# Altium project STM32F407.PrjPcb
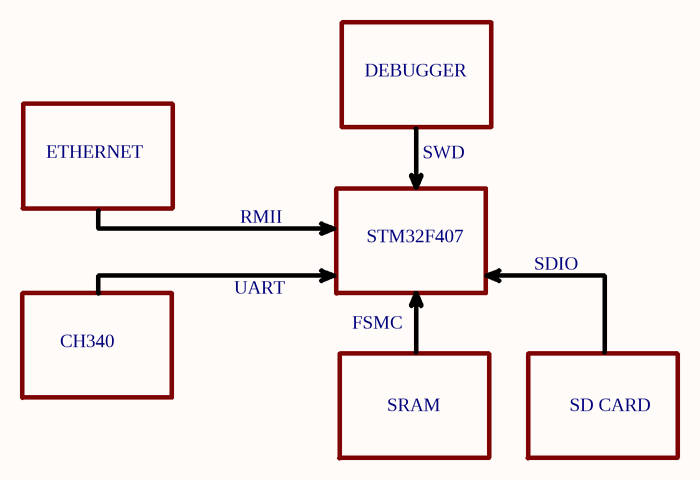
[diagram p0: Schematic block.SchDoc]
6 sheets, 146 parts. Net scope: flat (ports and power ports of the same name join across sheets).
Board file: F407-144pin.PcbDoc
Sheets:
  Schematic block.SchDoc
  Power.SchDoc
  ST-link V2.SchDoc
  MCU.SchDoc
  ETH.SchDoc
  Memory+GPIO.SchDoc

## Sheet Schematic block.SchDoc
size A4; SheetNumber: 1; SheetTotal: 6

### Notes on the sheet
- DEBUGGER
- ETHERNET
- SWD
- RMII
- UART
- STM32F407
- SDIO
- CH340
- FSMC
- SRAM
- SD CARD

## Sheet Power.SchDoc
size A4; SheetNumber: 2; SheetTotal: 6
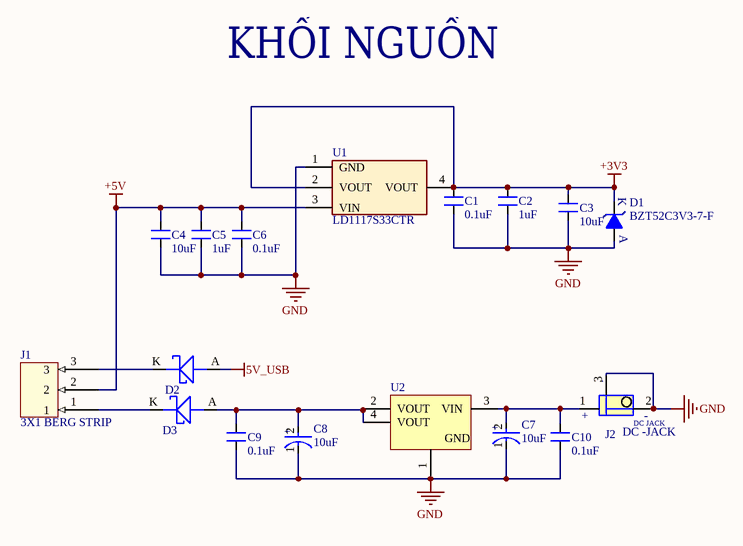
[diagram p1: Power.SchDoc]

### Parts
C1  0.1uF  [CAP_0805]
C2  1uF  [CAP_0805]
C3  10uF  [CAP_1206]
C4  10uF  [CAP_1206]
C5  1uF  [CAP_0805]
C6  0.1uF  [CAP_0805]
C7  10uF  [FP-293DA-MFG]
C8  10uF  [FP-293DA-MFG]
C9  0.1uF  [CAP_0805]
C10  0.1uF  [CAP_0805]
D1  BZT52C3V3-7-F  [DIO_SOD-123]
D2  MBRS130LT3G  [DIO_SMB_DO-214AA]  (value not drawn)
D3  MBRS130LT3G  [DIO_SMB_DO-214AA]  (value not drawn)
J1  3X1 BERG STRIP  [CON3_100_40D72_TH_ST-MALE]
J2  DC -JACK  [CON3_129_PJ-002A_TH_RA]
U1  LD1117S33CTR  [SOT223_3]
U2  LD1117S50CTR  [SOT-223_N]  (value not drawn)

### Nets
5V_USB: D2.A
+3V3: C1.2 C2.2 C3.2 D1.K U1.2(VOUT) U1.4(VOUT)
+5V: C4.2 C5.2 C6.2 J1.2 U1.3(VIN)
GND: C1.1 C2.1 C3.1 C4.1 C5.1 C6.1 C7.1(C) C8.1(C) C9.1 C10.1 D1.A J2.2 J2.3(-) U1.1(GND) U2.1(GND)
NetC7_2: C7.2(A) C10.2 J2.1 U2.3(VIN)
NetC8_2: C8.2(A) C9.2 D3.A U2.2(VOUT) U2.4(VOUT)
NetD2_K: D2.K J1.3
NetD3_K: D3.K J1.1

### Notes on the sheet
- KHỐI NGUỒN
- (in symbol CMP-00030-40940187-1) +
- (in symbol CON-PLG_3X1-228-DC_JACK) +; DC JACK

### Library data of the parts
C1 C6 C9 C10 = CAP_0.1uF-50V-10%-0805: 0.1µF ±10% 50V Ceramic Capacitor X7R 0805 (2012 Metric); Manufacturer: Samsung; Manufacturer Part Number: CL21B104KBCNNNC; Alternate Part Number-1: NA; Case/Package: 0805; Supplier-1: SIRICOM; Supplier Part Number-1: 0805B104K500CT
C2 C5 = CAP_1uF-50V-5%-0805: 1µF ±5% 50V Ceramic Capacitor X7R 0805 (2012 Metric); Manufacturer: Samsung; Manufacturer Part Number: CC0805JKX7R9BB105; Alternate Part Number-1: 0805F105M500NT; Case/Package: 0805; Supplier-1: SIRICOM; Supplier Part Number-1: CL21B105KBFNNNE
C3 C4 = CAP_10uF-50V-10%-1206: 10µF ±10% 50V Ceramic Capacitor X7R 1206 (3216 Metric); Manufacturer: KEMET; Manufacturer Part Number: CL31B106KBHNNNE; Alternate Part Number-1: GRT31CR61H106ME01L; Case/Package: 1206; Supplier-1: SIRICOM; Supplier Part Number-1: CC1206KKX5R9BB106
C7 C8 = CMP-00030-40940187-1: 293D105X0016A2TE3 Surface Mount Tantalum Capacitor, 1 uF, 16 V, ± 20%, -55 °C, 125 °C, 1206 [3216-18 Metric]; Ripple Current: 90mA; Capacitance: 1µF; Leakage Current: 500nA; Polarity: Polar; Voltage Rating (DC): 16V; Dissipation Factor: 4%; ESR (Equivalent Series Resistance): 9.3Ω; Case Code (Imperial): 1206; Case/Package: 1206; Schedule B: 8532210050, 8532210050; Height: 1.8mm; Mount: PCB, Surface Mount; Height - Seated (Max): 1.8034mm; Min Operating Temperature: -55°C; Max Operating Temperature: 125°C; Dielectric Material: Tantalum; Packaging: Tape and Reel; Radiation Hardening: No; Lead Free: Lead Free; Features: General Purpose; REACH SVHC: Unknown; Width: 1.6002mm; RoHS: Compliant; Tolerance: 20%; Termination: SMD/SMT; Length: 3.2mm; Depth: 1.6mm; Number of Pins: 2; Voltage Rating: 16V; NexarPartId: 40940187; Case Code (Metric): 3216
D1 = DIO-Z_3.3V-500mW-SOD123: Zener Diode 3.3V 500mW ±6% Surface Mount SOD-123; Manufacturer: Diodes Incorporated; Alternate Part Number-1: NA; Manufacturer Part Number: BZT52C3V3-7-F; Case/Package: SOD-123; Supplier-1: Digikey; Supplier Part Number-1: BZT52C3V3-FDICT-ND
D2 D3 = DIO-S_445mV-30V-2A-SMB: Diode Schottky 30V 2A Surface Mount SMB; Manufacturer: ON Semiconductor; Alternate Part Number-1: NA; Manufacturer Part Number: MBRS130LT3G; Case/Package: SMB; Supplier-1: ARROW; Supplier Part Number-1: MBRS130LT3G
J1 = CON-BS-PLG_3X1-100-ST-TH: 3 Pins, 1 Row 2.54mm Pitch, Straight bergstrip, Male; Manufacturer: NA; Manufacturer Part Number: RKI-1140; Case/Package: TH-CON; Supplier-1: SP ROAD; Supplier Part Number-1: NA; Alternate Part Number-1: NA
J2 = CON-PLG_3X1-228-DC_JACK: 3 Pins, 1 Row 228mil Pitch, right angle Connector, male; Manufacturer: JST; Manufacturer Part Number: PJ-002A; Alternate Part Number-1: NA; Case/Package: TH-CON; Supplier-1: SP ROAD; Supplier Part Number-1: NA
U1 = REG_15V-3.3V-0.9A-12W-SOT223: Linear Voltage Regulator IC 1 Output 800mA SOT-223; Manufacturer: STMicroelectronics; Alternate Part Number-1: NA; Manufacturer Part Number: LD1117S33CTR; Case/Package: SOT223; Supplier-1: SP ROAD; Supplier Part Number-1: LD1117S33CTR
U2 = CMP-0244-00311-1: Fixed Low Drop Positive Voltage Regulator, 5V, 4-Pin SOT-223, Tape and Reel; PackageReference: SOT-223; PackageVersion: 2010; ComponentLink2URL: http://www.st.com/internet/com/TECHNICAL_RESOURCES/TECHNICAL_LITERATURE/DATASHEET/CD00000544.pdf; ComponentLink1URL: http://www.st.com; ComponentLink2Description: Datasheet; DatasheetVersion: 1/11/2011; ComponentLink1Description: Manufacturer URL; PackageDescription: 4-Pin SOT-223 Package, 6.5 x 3.5 mm Body, 2.3 mm Pitch, 7 mm Lead Span

## Sheet ST-link V2.SchDoc
size A4; SheetNumber: 3; SheetTotal: 6
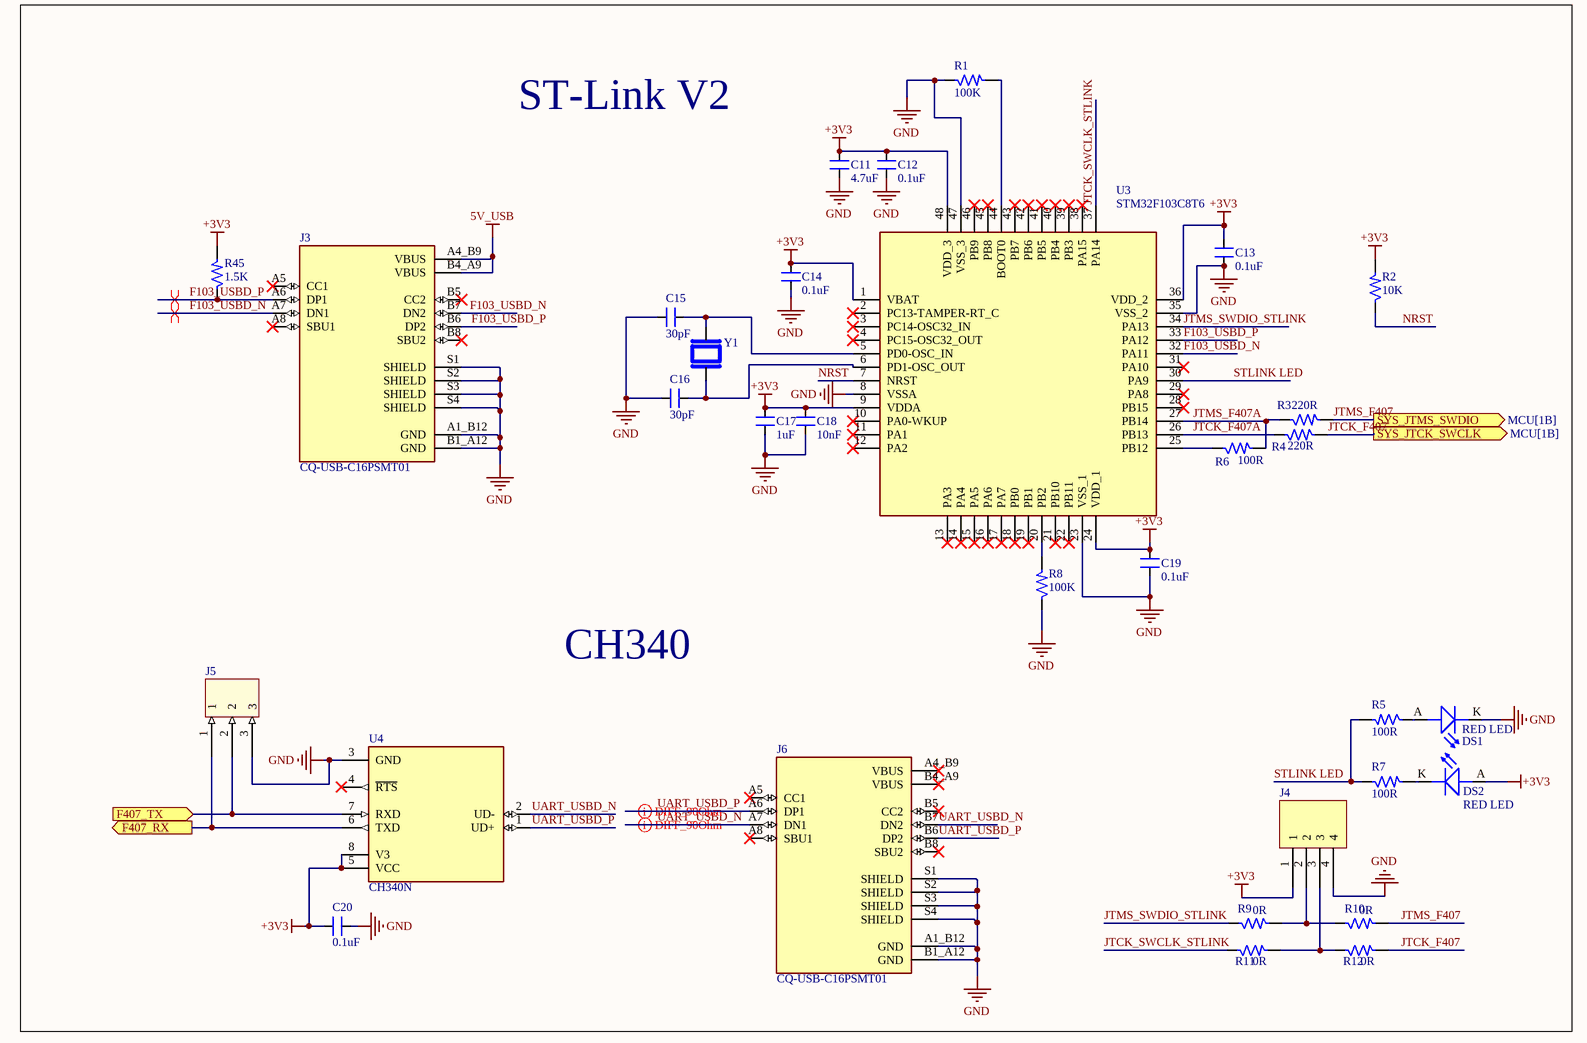
[diagram p2: ST-link V2.SchDoc]

### Parts
C11  4.7uF  [CAP_0805]
C12  0.1uF  [CAP_0805]
C13  0.1uF  [CAP_0805]
C14  0.1uF  [CAP_0805]
C15  30pF  [CAP_0805]
C16  30pF  [CAP_0805]
C17  1uF  [CAP_0805]
C18  10nF  [CAP_0805]
C19  0.1uF  [CAP_0805]
C20  0.1uF  [CAP_0805]
DS1  RED LED  [LED_0805]
DS2  RED LED  [LED_0805]
J3  CQ-USB-C16PSMT01  [SHENZHEN-CHUANGQIN-TECHNOLOGY_CQ-USB-C16PSMT01]
J4  4X1 BERG STRIP  [CON4_100_40D72_TH_ST_MALE]  (value not drawn)
J5  3X1 BERG STRIP  [CON3_100_40D72_TH_ST-MALE]  (value not drawn)
J6  CQ-USB-C16PSMT01  [SHENZHEN-CHUANGQIN-TECHNOLOGY_CQ-USB-C16PSMT01]
R1  100K  [RES_0603]
R2  10K  [RES_0603]
R3  220R  [RES_0805]
R4  220R  [RES_0805]
R5  100R  [RES_0805]
R6  100R  [RES_0805]
R7  100R  [RES_0805]
R8  100K  [RES_0603]
R9  0R  [RES_0805]
R10  0R  [RES_0805]
R11  0R  [RES_0805]
R12  0R  [RES_0805]
R45  1.5K  [RES_0805]
U3  STM32F103C8T6  [LQFP-48_19.6_393_58X11_SMD]
U4  CH340N  [SOIC127P600X160-8N]
Y1  ATS08A-E  [XTAL_HC49P488W43L1085T450H368]  (value not drawn)

### Ports
F407_RX (out, see MCU[1A]), F407_TX (in, see MCU[1A]), SYS_JTCK_SWCLK (out, see MCU[1B]), SYS_JTMS_SWDIO (out, see MCU[1B])

### Nets
5V_USB: J3.A4_B9(VBUS) J3.B4_A9(VBUS)
+3V3: C11.2 C12.2 C13.2 C14.2 C17.2 C18.2 C19.2 C20.2 DS2.A(ANODE) J4.1 R2.2 R45.2 U3.1(VBAT) U3.9(VDDA) U3.24(VDD_1) U3.36(VDD_2) U3.48(VDD_3) U4.5(VCC) U4.8(V3)
GND: C11.1 C12.1 C13.1 C14.1 C15.1 C16.1 C17.1 C18.1 C19.1 C20.1 DS1.K(CATHODE) J3.A1_B12(GND) J3.B1_A12(GND) J3.S1(SHIELD) J3.S2(SHIELD) J3.S3(SHIELD) J3.S4(SHIELD) J4.4 J5.3 J6.A1_B12(GND) J6.B1_A12(GND) J6.S1(SHIELD) J6.S2(SHIELD) J6.S3(SHIELD) J6.S4(SHIELD) R1.1 R8.1 U3.8(VSSA) U3.23(VSS_1) U3.35(VSS_2) U3.47(VSS_3) U4.3(GND)
F103_USBD_N: J3.A7(DN1) J3.B7(DN2) U3.32(PA11)
F103_USBD_P: J3.A6(DP1) J3.B6(DP2) R45.1 U3.33(PA12)
JTCK_F407: R4.2 R12.2 ; port SYS_JTCK_SWCLK
JTCK_F407A: R4.1 U3.26(PB13)
JTCK_SWCLK_STLINK: R11.1 U3.37(PA14)
JTMS_F407: R3.2 R10.2 ; port SYS_JTMS_SWDIO
JTMS_F407A: R3.1 R6.2 U3.27(PB14)
JTMS_SWDIO_STLINK: R9.1 U3.34(PA13)
NRST: R2.1 U3.7(NRST)
PA9: J5.2 U4.7(RXD) ; port F407_TX
PA10: J5.1 U4.6(TXD) ; port F407_RX
STLINK LED: R5.2 R7.1 U3.30(PA9)
UART_USBD_N: J6.A7(DN1) J6.B7(DN2) U4.2(UD-)
UART_USBD_P: J6.A6(DP1) J6.B6(DP2) U4.1(UD+)
NetC15_2: C15.2 U3.5(PD0-OSC_IN) Y1.2
NetC16_2: C16.2 U3.6(PD1-OSC_OUT) Y1.1
NetDS1_A: DS1.A(ANODE) R5.1
NetDS2_K: DS2.K(CATHODE) R7.2
NetJ4_2: J4.2 R9.2 R10.1
NetJ4_3: J4.3 R11.2 R12.1
NetR1_2: R1.2 U3.44(BOOT0)
NetR6_1: R6.1 U3.25(PB12)
NetR8_2: R8.2 U3.20(PB2)

Not connected (* = marked no-connect by the designer): J3 A5(CC1)* A8(SBU1)* B5(CC2)* B8(SBU2)*; J6 A4_B9(VBUS)* A5(CC1)* A8(SBU1)* B4_A9(VBUS)* B5(CC2)* B8(SBU2)*; U3 2(PC13-TAMPER-RT_C)* 3(PC14-OSC32_IN)* 4(PC15-OSC32_OUT)* 10(PA0-WKUP)* 11(PA1)* 12(PA2)* 13(PA3)* 14(PA4)* 15(PA5)* 16(PA6)* 17(PA7)* 18(PB0)* 19(PB1)* 21(PB10)* 22(PB11)* 28(PB15)* 29(PA8)* 31(PA10)* 38(PA15)* 39(PB3)* 40(PB4)* 41(PB5)* 42(PB6)* 43(PB7)* 45(PB8)* 46(PB9)*; U4 4(~{RTS})*

### Layout directives
differential pair: F103_USBD_N, F103_USBD_P, UART_USBD_N, UART_USBD_P

### Notes on the sheet
- ST-Link V2
- CH340

### Library data of the parts
C11 = CAP_4.7uF-50V-10%-0805: 4.7µF ±10% 50V Ceramic Capacitor X5R 0805 (2012 Metric); Manufacturer: Yageo; Manufacturer Part Number: GRM21BR61H475KE51L; Alternate Part Number-1: NA; Case/Package: 0805; Supplier-1: SIRICOM; Supplier Part Number-1: CL21A475KBQNNNE
C12-C14 C19 C20 = CAP_0.1uF-50V-10%-0805: as C1 on sheet Power; Case/Package: 0805; Supplier-1: SIRICOM; Supplier Part Number-1: 0805B104K500CT
C15 C16 = CAP_30pF-50V-10%-0805: ±10% 50V Ceramic Capacitor C0G, NP0 0805 (2012 Metric); Manufacturer Part Number: C0805C300K5GAC7800; Manufacturer: KEMET; Alternate Part Number: NA; Case/Package: 0805; Supplier-1: Digikey; Supplier Part Number-1: 399-17443-1-ND - Cut Tape (CT)
C17 = CAP_1uF-50V-5%-0805: as C2 on sheet Power; Case/Package: 0805; Supplier-1: SIRICOM; Supplier Part Number-1: CL21B105KBFNNNE
C18 = CAP_10nF-50V-10%-0805: 10000pF ±10% 50V Ceramic Capacitor X7R 0805 (2012 Metric); Manufacturer: Samsung; Manufacturer Part Number: C0805C103K5RECAUTO; Alternate Part Number-1: GRM2195C1H103JA01D; Case/Package: 0805; Supplier-1: SIRICOM; Supplier Part Number-1: 0805B103K500CT
DS1 DS2 = LED_RED-2V-20mA-0805: Red 631nm LED Indication - Discrete 2V 0805 (2012 Metric); Manufacturer: Vishay Lite-On; Manufacturer Part Number: LTST-C171KRKT; Alternate Part Number-1: NA; Case/Package: 0805; Supplier-1: SP ROAD; Supplier Part Number-1: LTST-C171KRKT
J3 J6 = CQ-USB-C16PSMT01: C Type USB Type-C Female Plug 16 Pin Connector Power Charger Jack Port; MF: Shenzen Chuangqin Technology; SnapEDA_Link: https://www.snapeda.com/parts/CQ-USB-C16PSMT01/Shenzen+Chuangqin+Technology/view-part/?ref=snap; Package: Package; Value: *; MP: CQ-USB-C16PSMT01; Check_prices: https://www.snapeda.com/parts/CQ-USB-C16PSMT01/Shenzen+Chuangqin+Technology/view-part/?ref=eda
J4 = CON-BS-PLG_4X1-100-ST-TH: 4 Pins, 1 Row 2.54mm Pitch, Straight bergstrip, Male; Manufacturer: NA; Manufacturer Part Number: NA; Case/Package: TH-CON; Supplier-1: SP ROAD; Supplier Part Number-1: NA; Alternate Part Number-1: NA
J5 = CON-BS-PLG_3X1-100-ST-TH: as J1 on sheet Power; Manufacturer Part Number: RKI-1140; Case/Package: TH-CON; Supplier-1: SP ROAD; Supplier Part Number-1: NA; Alternate Part Number-1: NA
R1 R8 = RES_100K-0.1W-1%-0603: 100 kOhms ±1% 0.1W, 1/10W Chip Resistor 0603 (1608 Metric) Automotive AEC-Q200 Thick Film; Manufacturer: Stackpole Electronics; Manufacturer Part Number: RMCF0603FT100K; Alternate Part Number-1: NA; Case/Package: 0603; Supplier-1: Arrow; Supplier Part Number-1: RMCF0603FT100K
R2 = RES_10K-0.1W-1%-0603: 10 kOhms ±1% 0.1W, 1/10W Chip Resistor 0603 (1608 Metric) Automotive AEC-Q200 Thick Film; Manufacturer: Walsin; Manufacturer Part Number: WR06X1002FTL; Alternate Part Number-1: 0603WAJ0103T5E; Case/Package: 0603; Supplier-1: SIRICOM; Supplier Part Number-1: WR06X1002FTL
R3 R4 = RES_220R-0.125W-1%-0805: 220 Ohms ±1% 0.125W, 1/8W Chip Resistor 0805 (2012 Metric) Automotive AEC-Q200 Thick Film; Manufacturer: Walsin; Manufacturer Part Number: WR08X2200FTL; Alternate Part Number-1: RS-05K2200FT; Case/Package: 0805; Supplier-1: SIRICOM; Supplier Part Number-1: WR08X2200FTL
R5-R7 = RES_100R-0.125W-1%-0805: 100 Ohms ±1% 0.125W, 1/8W Chip Resistor 0805 (2012 Metric) Automotive AEC-Q200, Pulse Withstanding Thick Film; Manufacturer: Walsin; Manufacturer Part Number: WR08X1000FTL; Case/Package: 0805; Supplier-1: SIRICOM; Supplier Part Number-1: WR08X1000FTL; Alternate Part Number-1: WR08X1000FTL
R9-R12 = RES_0R-0.125W-1%-0805: 0 Ohms Jumper 0.125W, 1/8W Chip Resistor 0805 (2012 Metric) Automotive AEC-Q200 Thick Film; Manufacturer: Walsin; Manufacturer Part Number: WR08X000PTL; Case/Package: 0805; Supplier-1: SIRICOM; Supplier Part Number-1: WR08X000PTL; Alternate Part Number-1: WR08X000PTL
R45 = RES_1.5K-0.125W-1%-0805: 1.5 kOhms ±1% 0.125W, 1/8W Chip Resistor 0805 (2012 Metric) Thick Film; Manufacturer: TE Connectivity Passive Product; Manufacturer Part Number: CRG0805F1K5; Alternate Part Number-1: NA; Case/Package: 0805; Supplier-1: SIRICOM; Supplier Part Number-1: NA
U3 = IC_STM32F103C8T6: ARM® Cortex®-M3 STM32F1 Microcontroller IC 32-Bit 72MHz 64KB (64K x 8) FLASH 48-LQFP (7x7); Manufacturer: STMicroelectronics; Alternate Part Number-1: NA; Manufacturer Part Number: STM32F103C8T6; Case/Package: LQFP48; Supplier-1: LCSC; Supplier Part Number-1: STM32F103C8T6
U4 = CH340N: USB to Serial Port Chip; MF: WCH; SnapEDA_Link: https://www.snapeda.com/parts/CH340N/WCH/view-part/?ref=snap; Package: Package; Value: *; MP: CH340N; Check_prices: https://www.snapeda.com/parts/CH340N/WCH/view-part/?ref=eda
Y1 = ATS08A-E: 8 MHz Â±30ppm Crystal 20pF 60 Ohms HC-49/US; MF: CTS; SnapEDA_Link: https://www.snapeda.com/parts/ATS08A-E/CTS+Components/view-part/?ref=snap; Package: HC-49/US CTS-Frequency Controls; Value: *; MP: ATS08A-E; Check_prices: https://www.snapeda.com/parts/ATS08A-E/CTS+Components/view-part/?ref=eda

## Sheet MCU.SchDoc
size A4; SheetNumber: 4; SheetTotal: 6
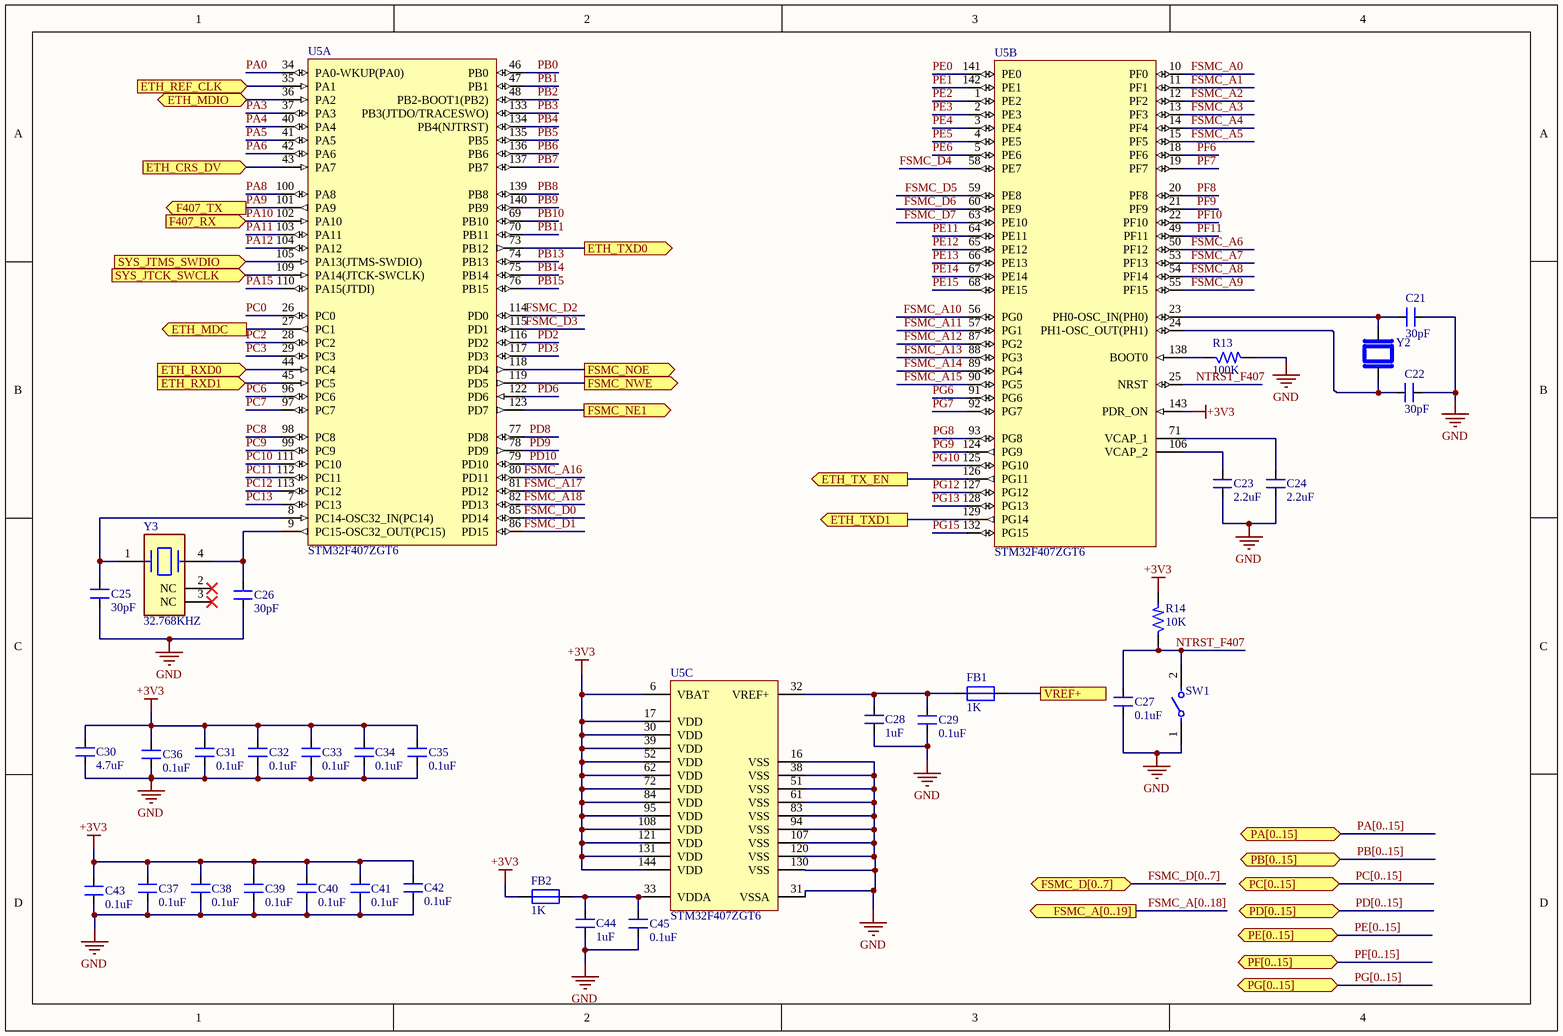
[diagram p3: MCU.SchDoc]

### Parts
C21  30pF  [CAP_0805]
C22  30pF  [CAP_0805]
C23  2.2uF  [CAP_0805]
C24  2.2uF  [CAP_0805]
C25  30pF  [CAP_0805]
C26  30pF  [CAP_0805]
C27  0.1uF  [CAP_0805]
C28  1uF  [CAP_0805]
C29  0.1uF  [CAP_0805]
C30  4.7uF  [CAP_0805]
C31  0.1uF  [CAP_0805]
C32  0.1uF  [CAP_0805]
C33  0.1uF  [CAP_0805]
C34  0.1uF  [CAP_0805]
C35  0.1uF  [CAP_0805]
C36  0.1uF  [CAP_0805]
C37  0.1uF  [CAP_0805]
C38  0.1uF  [CAP_0805]
C39  0.1uF  [CAP_0805]
C40  0.1uF  [CAP_0805]
C41  0.1uF  [CAP_0805]
C42  0.1uF  [CAP_0805]
C43  0.1uF  [CAP_0805]
C44  1uF  [CAP_0805]
C45  0.1uF  [CAP_0805]
FB1  1K  [IND_0805]
FB2  1K  [IND_0805]
R13  100K  [RES_0805]
R14  10K  [RES_0603]
SW1  147873-1  [FP-147873-1-MFG]  (value not drawn)
U5  STM32F407ZGT6  [STM-LQFP144_L]  (parts A,B,C of 3)
Y2  ATS08A-E  [XTAL_HC49P488W43L1085T450H368]  (value not drawn)
Y3  32.768KHZ  [FP-ABS25-MFG]

### Ports
ETH_CRS_DV (in, see ETH[1B]), ETH_MDC (out, see ETH[1B]), ETH_MDIO (bidir, see ETH[1B]), ETH_REF_CLK (in, see ETH[2A]), ETH_RXD0 (in, see ETH[1C]), ETH_RXD1 (in, see ETH[1C]), ETH_TX_EN (out, see ETH[1B]), ETH_TXD0 (out, see ETH[1B]), ETH_TXD1 (out, see ETH[1B]), F407_RX (in, see ST-link V2[1D]), F407_TX (out, see ST-link V2[1D]), FSMC_A[0..19] (out, see Memory+GPIO[1A]), FSMC_D[0..7] (bidir, see Memory+GPIO[1A]), FSMC_NE1 (out, see Memory+GPIO[2D]), FSMC_NOE (out, see Memory+GPIO[2D]), FSMC_NWE (out, see Memory+GPIO[2D]), PA[0..15] (bidir, see Memory+GPIO[1A]), PB[0..15] (bidir, see Memory+GPIO[1A]), PC[0..15] (bidir, see Memory+GPIO[1A]), PD[0..15] (bidir, see Memory+GPIO[1B]), PE[0..15] (bidir, see Memory+GPIO[1B]), PF[0..15] (bidir, see Memory+GPIO[1B]), PG[0..15] (bidir, see Memory+GPIO[1B]), SYS_JTCK_SWCLK (in, see ST-link V2[3B]), SYS_JTMS_SWDIO (in, see ST-link V2[3B]), VREF+ (see Memory+GPIO[1A])

### Nets
+3V3: C30.2 C31.2 C32.2 C33.2 C34.2 C35.2 C36.2 C37.2 C38.2 C39.2 C40.2 C41.2 C42.2 C43.2 FB2.1 R14.2 U5.6(VBAT) U5.17(VDD) U5.30(VDD) U5.39(VDD) U5.52(VDD) U5.62(VDD) U5.72(VDD) U5.84(VDD) U5.95(VDD) U5.108(VDD) U5.121(VDD) U5.131(VDD) U5.143(PDR_ON) U5.144(VDD)
GND: C21.2 C22.2 C23.1 C24.1 C25.1 C26.1 C27.1 C28.1 C29.1 C30.1 C31.1 C32.1 C33.1 C34.1 C35.1 C36.1 C37.1 C38.1 C39.1 C40.1 C41.1 C42.1 C43.1 C44.1 C45.1 R13.2 SW1.1 U5.16(VSS) U5.31(VSSA) U5.38(VSS) U5.51(VSS) U5.61(VSS) U5.83(VSS) U5.94(VSS) U5.107(VSS) U5.120(VSS) U5.130(VSS)
ETH_CRS_DV: U5.43(PA7) ; port ETH_CRS_DV
ETH_MDC: U5.27(PC1) ; port ETH_MDC
ETH_MDIO: U5.36(PA2) ; port ETH_MDIO
ETH_RXD0: U5.44(PC4) ; port ETH_RXD0
ETH_RXD1: U5.45(PC5) ; port ETH_RXD1
ETH_TX_EN: U5.126(PG11) ; port ETH_TX_EN
ETH_TXD0: U5.73(PB12) ; port ETH_TXD0
ETH_TXD1: U5.129(PG14) ; port ETH_TXD1
FSMC_A0: U5.10(PF0)
FSMC_A1: U5.11(PF1)
FSMC_A2: U5.12(PF2)
FSMC_A3: U5.13(PF3)
FSMC_A4: U5.14(PF4)
FSMC_A5: U5.15(PF5)
FSMC_A6: U5.50(PF12)
FSMC_A7: U5.53(PF13)
FSMC_A8: U5.54(PF14)
FSMC_A9: U5.55(PF15)
FSMC_A10: U5.56(PG0)
FSMC_A11: U5.57(PG1)
FSMC_A12: U5.87(PG2)
FSMC_A13: U5.88(PG3)
FSMC_A14: U5.89(PG4)
FSMC_A15: U5.90(PG5)
FSMC_A16: U5.80(PD11)
FSMC_A17: U5.81(PD12)
FSMC_A18: U5.82(PD13)
FSMC_D0: U5.85(PD14)
FSMC_D1: U5.86(PD15)
FSMC_D2: U5.114(PD0)
FSMC_D3: U5.115(PD1)
FSMC_D4: U5.58(PE7)
FSMC_D5: U5.59(PE8)
FSMC_D6: U5.60(PE9)
FSMC_D7: U5.63(PE10)
FSMC_NE1: U5.123(PD7) ; port FSMC_NE1
FSMC_NOE: U5.118(PD4) ; port FSMC_NOE
FSMC_NWE: U5.119(PD5) ; port FSMC_NWE
JTCK_F407: U5.109(PA14(JTCK-SWCLK)) ; port SYS_JTCK_SWCLK
JTMS_F407: U5.105(PA13(JTMS-SWDIO)) ; port SYS_JTMS_SWDIO
NTRST_F407: C27.2 R14.1 SW1.2 U5.25(NRST)
OSC_IN: U5.35(PA1) ; port ETH_REF_CLK
PA0: U5.34(PA0-WKUP(PA0))
PA3: U5.37(PA3)
PA4: U5.40(PA4)
PA5: U5.41(PA5)
PA6: U5.42(PA6)
PA8: U5.100(PA8)
PA9: U5.101(PA9) ; port F407_TX
PA10: U5.102(PA10) ; port F407_RX
PA11: U5.103(PA11)
PA12: U5.104(PA12)
PA15: U5.110(PA15(JTDI))
PB0: U5.46(PB0)
PB1: U5.47(PB1)
PB2: U5.48(PB2-BOOT1(PB2))
PB3: U5.133(PB3(JTDO/TRACESWO))
PB4: U5.134(PB4(NJTRST))
PB5: U5.135(PB5)
PB6: U5.136(PB6)
PB7: U5.137(PB7)
PB8: U5.139(PB8)
PB9: U5.140(PB9)
PB10: U5.69(PB10)
PB11: U5.70(PB11)
PB13: U5.74(PB13)
PB14: U5.75(PB14)
PB15: U5.76(PB15)
PC0: U5.26(PC0)
PC2: U5.28(PC2)
PC3: U5.29(PC3)
PC6: U5.96(PC6)
PC7: U5.97(PC7)
PC8: U5.98(PC8)
PC9: U5.99(PC9)
PC10: U5.111(PC10)
PC11: U5.112(PC11)
PC12: U5.113(PC12)
PC13: U5.7(PC13)
PD2: U5.116(PD2)
PD3: U5.117(PD3)
PD6: U5.122(PD6)
PD8: U5.77(PD8)
PD9: U5.78(PD9)
PD10: U5.79(PD10)
PE0: U5.141(PE0)
PE1: U5.142(PE1)
PE2: U5.1(PE2)
PE3: U5.2(PE3)
PE4: U5.3(PE4)
PE5: U5.4(PE5)
PE6: U5.5(PE6)
PE11: U5.64(PE11)
PE12: U5.65(PE12)
PE13: U5.66(PE13)
PE14: U5.67(PE14)
PE15: U5.68(PE15)
PF6: U5.18(PF6)
PF7: U5.19(PF7)
PF8: U5.20(PF8)
PF9: U5.21(PF9)
PF10: U5.22(PF10)
PF11: U5.49(PF11)
PG6: U5.91(PG6)
PG7: U5.92(PG7)
PG8: U5.93(PG8)
PG9: U5.124(PG9)
PG10: U5.125(PG10)
PG12: U5.127(PG12)
PG13: U5.128(PG13)
PG15: U5.132(PG15)
VREF+: FB1.2 ; port VREF+
NetC21_1: C21.1 U5.23(PH0-OSC_IN(PH0)) Y2.2
NetC22_1: C22.1 U5.24(PH1-OSC_OUT(PH1)) Y2.1
NetC23_2: C23.2 U5.106(VCAP_2)
NetC24_2: C24.2 U5.71(VCAP_1)
NetC25_2: C25.2 U5.8(PC14-OSC32_IN(PC14)) Y3.1
NetC26_2: C26.2 U5.9(PC15-OSC32_OUT(PC15)) Y3.4
NetC28_2: C28.2 C29.2 FB1.1 U5.32(VREF+)
NetC44_2: C44.2 C45.2 FB2.2 U5.33(VDDA)
NetR13_1: R13.1 U5.138(BOOT0)

Not connected (* = marked no-connect by the designer): Y3 2(NC)* 3(NC)*

### Buses and harness runs
bus FSMC_A[0..18] = port FSMC_A[0..19]
bus FSMC_D[0..7] = port FSMC_D[0..7]
bus PA[0..15] = port PA[0..15]
bus PB[0..15] = port PB[0..15]
bus PC[0..15] = port PC[0..15]
bus PD[0..15] = port PD[0..15]
bus PE[0..15] = port PE[0..15]
bus PF[0..15] = port PF[0..15]
bus PG[0..15] = port PG[0..15]

### Library data of the parts
C21 C22 C25 C26 = CAP_30pF-50V-10%-0805: as C15 on sheet ST-link V2; Case/Package: 0805; Supplier-1: Digikey; Supplier Part Number-1: 399-17443-1-ND - Cut Tape (CT)
C23 C24 = CAP_2.2uF-25V-10%-0805: 2.2µF ±10% 25V Ceramic Capacitor X7R 0805 (2012 Metric); Manufacturer: KEMET; Manufacturer Part Number: CL21B225KAFNFNE; Alternate Part Number-1: NA; Case/Package: 0805; Supplier-1: SIRICOM; Supplier Part Number-1: CL21A225KAFNNNE
C27 C29 C31-C43 C45 = CAP_0.1uF-50V-10%-0805: as C1 on sheet Power; Case/Package: 0805; Supplier-1: SIRICOM; Supplier Part Number-1: 0805B104K500CT
C28 C44 = CAP_1uF-50V-5%-0805: as C2 on sheet Power; Case/Package: 0805; Supplier-1: SIRICOM; Supplier Part Number-1: CL21B105KBFNNNE
C30 = CAP_4.7uF-50V-10%-0805: as C11 on sheet ST-link V2; Case/Package: 0805; Supplier-1: SIRICOM; Supplier Part Number-1: CL21A475KBQNNNE
FB1 FB2 = FB_1K-100MHZ-1.6A-0805: 1 kOhms @ 100MHz 1 Power Line Ferrite Bead 0805 (2012 Metric) 1.6A; Manufacturer: Laird; Manufacturer Part Number: BLM21SP102SH1D; Alternate Part Number-1: NA; Case/Package: 0805; Supplier-1: SIRICOM; Supplier Part Number-1: ACMS201209A102
R13 = RES_100K-0.125W-1%-0805: 100 kOhms ±1% 0.125W, 1/8W Chip Resistor 0805 (2012 Metric) Automotive AEC-Q200 Thick Film; Manufacturer: Walsin; Manufacturer Part Number: WR08X1003FTL; Alternate Part Number-1: NA; Case/Package: 0805; Supplier-1: SIRICOM; Supplier Part Number-1: WR08X1003FTL
R14 = RES_10K-0.1W-1%-0603: as R2 on sheet ST-link V2; Case/Package: 0603; Supplier-1: SIRICOM; Supplier Part Number-1: WR06X1002FTL
SW1 = CMP-03407-000005-1: SWITCH TACTILE SPST-NO 0.05A 24V; Manufacturer: TE Connectivity; Contact Resistance: 100mΩ; Operating Force: 180gf; Electromechanical Life: 40000Cycles; Contact Current Rating: 50mA; Throw Configuration: SPST-NO; Mouser Description: Switch Tactile OFF (ON) SPST Rectangular Button J-Bend 0.05A 24VDC 1.77N SMD T/R; Mount: Surface Mount; Height: 5.5mm; Category: Switch; RoHS: TRUE; Temperature Range High: +85°C; ComponentLink2Description: Datasheet; Temperature Range Low: -35°C; Device Class L1: Electromechanical; Device Class L2: Switches; Package: 0; Temperature: -35°C to +85°C; Device Class L3: Tactile Switches; Automotive: No; Manufacturer Part Number: 147873-1; ComponentLink2URL: https://www.te.com/commerce/DocumentDelivery/DDEController?Action=showdoc&DocId=Customer+Drawing%7F147873%7FK3%7Fpdf%7FEnglish%7FENG_CD_147873_K3.pdf%7F147873-1; Lead Free: Yes; Voltage Rating Dc: 24V; Octopart: https://octopart.com/147873-1-te+connectivity-40818451; Digikey Description: SWITCH TACTILE SPST-NO 0.05A 24V
U5 = CMP-0243-00025-3: ARM Cortex-M4 32-bit MCU+FPU, 210 DMIPS, 1024 kB Flash, 192 kB Internal RAM, 114 I/Os, 144-pin LQFP, -40 to 85 degC, Tray; Manufacturer: STMicroelectronics; I/Os (High Current): 114; FLASH Size (Prog) (kB): 1024; Supply Voltage(Vcc) max (V): 3.6; Internal RAM Size (kB): 192; Operating Frequency(F) (Processor speed) (MHz): 168; Supply Voltage(Vcc) min (V): 1.8; D/A Converter: 2x12-bit; PartNumber: STM32F407ZGT6; PackageDescription: 144-Pin Low Profile Quad Flat Package, 20 x 20 mm Body, 0.5 mm Pitch; Mounting Technology: Surface Mount; ComponentLink3Description: Package Specification; ComponentLink3URL: http://www.st.com/st-web-ui/static/active/en/resource/technical/document/datasheet/DM00037051.pdf; ComponentLink1URL: http://www.st.com/web/en/home.html; ComponentLink2URL: http://www.st.com/st-web-ui/static/active/en/resource/technical/document/datasheet/DM00037051.pdf; Core: ARM Cortex-M4; ComponentLink1Description: Manufacturer URL; PackageVersion: Rev. 4, 06/2013; ComponentLink2Description: Datasheet; PackageReference: LQFP144; Packing: Tray; DatasheetVersion: Rev. 4
Y2 = ATS08A-E: as Y1 on sheet ST-link V2; SnapEDA_Link: https://www.snapeda.com/parts/ATS08A-E/CTS+Components/view-part/?ref=snap; Package: HC-49/US CTS-Frequency Controls; Value: *; MP: ATS08A-E; Check_prices: https://www.snapeda.com/parts/ATS08A-E/CTS+Components/view-part/?ref=eda
Y3 = CMP-2000-05037-2: CRYSTAL 32.7680KHZ 12.5PF SMD; ESR (Equivalent Series Resistance): 50kR; Tolerance: 20ppm; Width: 3.8mm; REACH SVHC: No SVHC; Load Capacitance: 12.5pF; Case/Package: SMD/SMT; Radiation Hardening: No; Series: ABS25; Number of Pins: 4; Mount: Surface Mount; RoHS Compliant: Yes; Packaging: Tape and Reel; Termination: SMD/SMT; Frequency Tolerance: 20ppm; Lead Free: Lead Free; Package Quantity: 1000; Min Operating Temperature: -40°C; Height: 0.098inch; Length: 8mm; Frequency: 32.768kHz; Max Operating Temperature: 85°C; Series Resistance: 50kR; Operating Frequency: 32.768 kHz; Depth: 3.8mm

## Sheet ETH.SchDoc
size A4; SheetNumber: 5; SheetTotal: 6
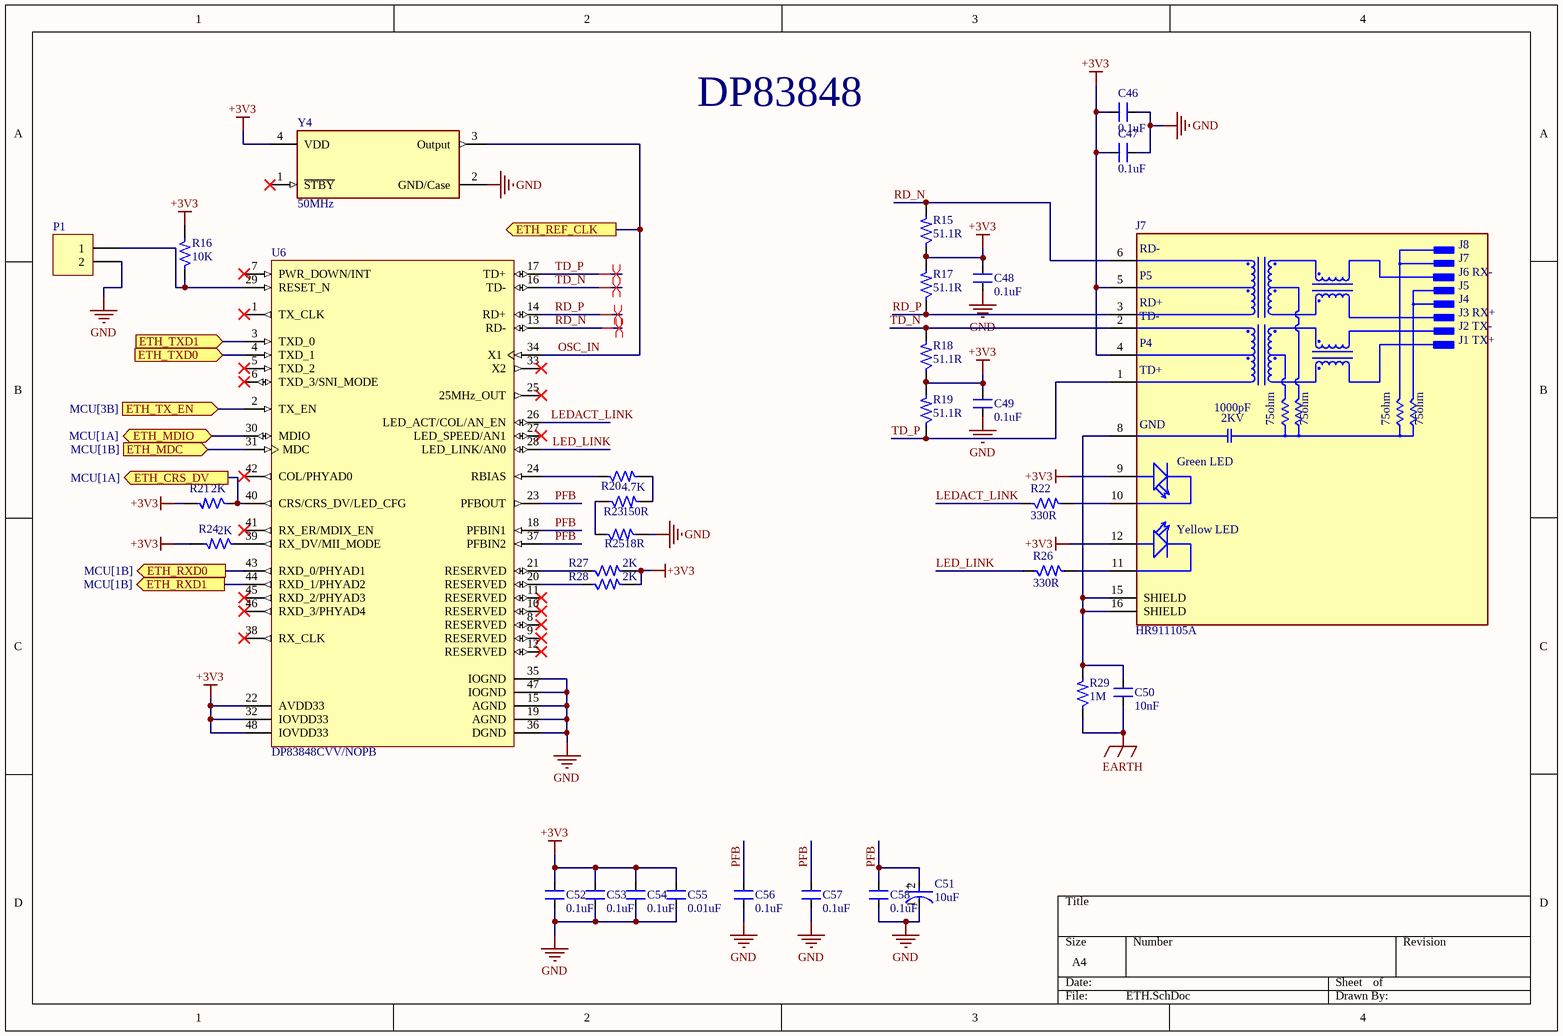
[diagram p4: ETH.SchDoc]

### Parts
C46  0.1uF  [CAP_0805]
C47  0.1uF  [CAP_0805]
C48  0.1uF  [CAP_0805]
C49  0.1uF  [CAP_0805]
C50  10nF  [CAP_P196_102X287_H332_RAD_TH]
C51  10uF  [FP-293DA-MFG]
C52  0.1uF  [CAP_0805]
C53  0.1uF  [CAP_0805]
C54  0.1uF  [CAP_0805]
C55  0.01uF  [CAP_0805]
C56  0.1uF  [CAP_0805]
C57  0.1uF  [CAP_0805]
C58  0.1uF  [CAP_0805]
J7  HR911105A  [HANRUN_HR911105A]
P1  BERSTICK 2.5MM, MALE  [CON2_100_43D62_TH_ST]  (value not drawn)
R15  51.1R  [RES_0603]
R16  10K  [RES_0805]
R17  51.1R  [RES_0603]
R18  51.1R  [RES_0603]
R19  51.1R  [RES_0603]
R20  4.7K  [RES_0805]
R21  2K  [RES_0805]
R22  330R  [RES_0805]
R23  150R  [RES_0805]
R24  2K  [RES_0805]
R25  18R  [RES_0805]
R26  330R  [RES_0805]
R27  2K  [RES_0805]
R28  2K  [RES_0805]
R29  1M  [RES_1206]
U6  DP83848CVV/NOPB  [PT0048A_M]
Y4  50MHz  [FP-ASE-MFG]

### Ports
ETH_CRS_DV (out, see MCU[1A]), ETH_MDC (in, see MCU[1B]), ETH_MDIO (bidir, see MCU[1A]), ETH_REF_CLK (out, see MCU[1A]), ETH_RXD0 (out, see MCU[1B]), ETH_RXD1 (out, see MCU[1B]), ETH_TX_EN (in, see MCU[3B]), ETH_TXD0 (in, see MCU[2A]), ETH_TXD1 (in, see MCU[3C])

### Nets
+3V3: C46.1 C47.1 C48.2 C49.2 C52.1 C53.1 C54.2 C55.2 J7.4(P4) J7.5(P5) J7.9(GA) J7.12(YA) R15.1 R16.2 R17.2 R18.1 R19.2 R21.2 R24.2 R27.2 R28.2 U6.22(AVDD33) U6.32(IOVDD33) U6.48(IOVDD33) Y4.4(VDD)
EARTH: C50.1 R29.1
GND: C46.2 C47.2 C48.1 C49.1 C51.1(C) C52.2 C53.2 C54.1 C55.1 C56.2 C57.2 C58.1 P1.2 R25.2 U6.15(AGND) U6.19(AGND) U6.35(IOGND) U6.36(DGND) U6.47(IOGND) Y4.2(GND/Case)
ETH_CRS_DV: R21.1 U6.40(CRS/CRS_DV/LED_CFG) ; port ETH_CRS_DV
ETH_MDC: U6.31(MDC) ; port ETH_MDC
ETH_MDIO: U6.30(MDIO) ; port ETH_MDIO
ETH_RXD0: U6.43(RXD_0/PHYAD1) ; port ETH_RXD0
ETH_RXD1: U6.44(RXD_1/PHYAD2) ; port ETH_RXD1
ETH_TX_EN: U6.2(TX_EN) ; port ETH_TX_EN
ETH_TXD0: U6.4(TXD_1) ; port ETH_TXD0
ETH_TXD1: U6.3(TXD_0) ; port ETH_TXD1
LED_LINK: R26.1 U6.28(LED_LINK/AN0)
LEDACT_LINK: R22.1 U6.26(LED_ACT/COL/AN_EN)
OSC_IN: U6.34(X1) Y4.3(Output) ; port ETH_REF_CLK
PFB: C51.2(A) C56.1 C57.1 C58.2 U6.18(PFBIN1) U6.23(PFBOUT) U6.37(PFBIN2)
RD_N: J7.6(RD-) R15.2 U6.13(RD-)
RD_P: J7.3(RD+) R17.1 U6.14(RD+)
TD_N: J7.2(TD-) R18.2 U6.16(TD-)
TD_P: J7.1(TD+) R19.1 U6.17(TD+)
NetC50_2: C50.2 J7.8(GND) J7.15(SHIELD) J7.16(SHIELD) R29.2
NetJ7_10: J7.10(GC) R22.2
NetJ7_11: J7.11(YC) R26.2
NetP1_1: P1.1 R16.1 U6.29(RESET_N)
NetR20_1: R20.1 U6.24(RBIAS)
NetR20_2: R20.2 R23.2
NetR23_1: R23.1 R25.1
NetR24_1: R24.1 U6.39(RX_DV/MII_MODE)
NetR27_1: R27.1 U6.21(RESERVED)
NetR28_1: R28.1 U6.20(RESERVED)

Not connected (* = marked no-connect by the designer): U6 1(TX_CLK)* 5(TXD_2)* 6(TXD_3/SNI_MODE)* 7(PWR_DOWN/INT)* 8(RESERVED)* 9(RESERVED)* 10(RESERVED)* 11(RESERVED)* 12(RESERVED)* 25(25MHz_OUT)* 27(LED_SPEED/AN1)* 33(X2)* 38(RX_CLK)* 41(RX_ER/MDIX_EN)* 42(COL/PHYAD0)* 45(RXD_2/PHYAD3)* 46(RXD_3/PHYAD4)*; Y4 1(~{STBY})*

### Layout directives
differential pair: RD_N, RD_P, TD_N, TD_P

### Notes on the sheet
- DP83848
- (in symbol CMP-00030-40940187-1) +
- (in symbol HR911105A) J8; J6 RX-; J5; J4; J3 RX+; J2 TX-; J1 TX+; 1000pF; 2KV; 75ohm; Green LED; Yellow LED

### Library data of the parts
C46-C49 C52-C58 = CAP_0.1uF-50V-20%-0805: 0.1µF ±20% 50V Ceramic Capacitor X7R 0805 (2012 Metric); Manufacturer: Samsung Electro-Mechanics; Manufacturer Part Number: CL21B104MBCNNNC; Alternate Part Number-1: NA; Case/Package: 0805; Supplier-1: SIRICOM; Supplier Part Number-1: 0805B104K500CT
C50 = CAP_10nF-1KV-10%-RAD-TH: 10000pF ±10% 1000V (1kV) Ceramic Capacitor X7R Radial; Manufacturer: Yageo; Manufacturer Part Number: RDER73A103K2K1H03B; Alternate Part Number-1: NA; Case/Package: TH; Supplier-1: SP ROAD; Supplier Part Number-1: RDER73A103K2K1H03B
C51 = CMP-00030-40940187-1: as C7 on sheet Power; Case Code (Imperial): 1206; Case/Package: 1206; Schedule B: 8532210050, 8532210050; Height: 1.8mm; Mount: PCB, Surface Mount; Height - Seated (Max): 1.8034mm; Min Operating Temperature: -55°C; Max Operating Temperature: 125°C; Dielectric Material: Tantalum; Packaging: Tape and Reel; Radiation Hardening: No; Lead Free: Lead Free; Features: General Purpose; REACH SVHC: Unknown; Width: 1.6002mm; RoHS: Compliant; Tolerance: 20%; Termination: SMD/SMT; Length: 3.2mm; Depth: 1.6mm; Number of Pins: 2; Voltage Rating: 16V; NexarPartId: 40940187; Case Code (Metric): 3216
J7 = HR911105A: DIP RJ45 Connector;; MF: hanrun; SnapEDA_Link: https://www.snapeda.com/parts/HR911105A/HanRun/view-part/?ref=snap; Package: None; MP: HR911105A; Check_prices: https://www.snapeda.com/parts/HR911105A/HanRun/view-part/?ref=eda; Price: None; Value: *; Availability: Not in stock
P1 = CON-BS-PLG_2X1-100-ST-TH: 2 Pins, 1 Row 2.54mm Pitch, Straight bergstrip, Male; Manufacturer Part Number: NA; Manufacturer: Samtec; Case/Package: TH-CON; Supplier-1: SP ROAD; Supplier Part Number-1: NA; Alternate Part Number-1: NA
R15 R17-R19 = RES_51.1R-0.1W-1%-0603: 51.1 Ohms ±1% 0.1W, 1/10W Chip Resistor 0603 (1608 Metric) Thick Film; Manufacturer: Vishay Dale; Manufacturer Part Number: CRCW060351R1FKEAC; Alternate Part Number-1: NA; Case/Package: 0603; Supplier-1: Digikey; Supplier Part Number-1: 541-5468-1-ND - Cut Tape (CT)
R16 = RES_10K-0.125W-1%-0805: 10 kOhms ±1% 0.125W, 1/8W Chip Resistor 0805 (2012 Metric) Automotive AEC-Q200 Thick Film; Manufacturer: CTS; Manufacturer Part Number: WR08X1002FTL; Case/Package: 0805; Supplier-1: SIRICOM; Supplier Part Number-1: WR08X1002FTL; Alternate Part Number-1: WR08X1002FTL
R20 = RES_4.7K-0.125W-1%-0805: 4.7 kOhms ±1% 0.125W, 1/8W Chip Resistor 0805 (2012 Metric) Moisture Resistant Thick Film; Manufacturer: TE Connectivity; Manufacturer Part Number: RC0805FR-074K7L; Alternate Part Number-1: 0805W8F4701T5E; Case/Package: 0805; Supplier-1: SIRICOM; Supplier Part Number-1: WR08X4701FTL
R21 R24 R27 R28 = RES_2K-0.125W-1%-0805: 2 kOhms ±1% 0.125W, 1/8W Chip Resistor 0805 (2012 Metric) Moisture Resistant Thick Film; Manufacturer: TE Connectivity; Manufacturer Part Number: RC0805FR-072KL; Alternate Part Number-1: NA; Case/Package: 0805; Supplier-1: SIRICOM; Supplier Part Number-1: WR08X2001FTL
R22 R26 = RES_330R-0.125W-1%-0805: 330 Ohms ±1% 0.125W, 1/8W Chip Resistor 0805 (2012 Metric) Automotive AEC-Q200 Thick Film; Manufacturer: Walsin; Manufacturer Part Number: WR08X3300FTL; Alternate Part Number-1: NA; Case/Package: 0805; Supplier-1: SIRICOM; Supplier Part Number-1: WR08X3300FTL
R23 = RES_150R-0.125W-1%-0805: 150 Ohms ±1% 0.125W, 1/8W Chip Resistor 0805 (2012 Metric) Automotive AEC-Q200 Thick Film; Manufacturer: Walsin; Manufacturer Part Number: WR08X1500FTL; Alternate Part Number-1: NA; Case/Package: 0805; Supplier-1: SIRICOM; Supplier Part Number-1: WR12X1500FTL
R25 = RES_18.7K-0.125W-1%-0805: 18.7 kOhms ±1% 0.125W, 1/8W Chip Resistor 0805 (2012 Metric) Automotive AEC-Q200 Thick Film; Manufacturer: Yageo; Manufacturer Part Number: RMCF0805FT18K7; Alternate Part Number-1: NA; Case/Package: 0805; Supplier-1: SIRICOM; Supplier Part Number-1: WR08X1872FTL
R29 = RES_1M-0.25W-1%-1206: 1 MOhms ±1% 0.25W, 1/4W Chip Resistor 1206 (3216 Metric) Automotive AEC-Q200, High Voltage Thick Film; Manufacturer: Walsin; Manufacturer Part Number: WR12X1004FTL; Alternate Part Number-1: NA; Case/Package: 1206; Supplier-1: SIRICOM; Supplier Part Number-1: WR12X1004FTL
U6 = CMP-0058-00766-4: PHYTER® Commercial Temperature Single Port 10/100 Mb/s Ethernet Physical Layer Transceiver, 48-pin LQFP, Pb-Free, 250 Tray; Manufacturer: Texas Instruments; CompType: Interface IC; PowerWise: N; PackageTopMarking: NSUZXYTT*DP83848VV*VBC; High-Reliability: Y; PartNumber: DP83848CVV/NOPB; RoHS: Y; PackageDescription: LQFP, 7 x 7 x 1.4mm, 48 Lead, 0.5mm Pitch; ComponentLink1Description: Datasheet URL; ComponentLink1URL: http://www.ti.com/general/docs/lit/getliterature.tsp?genericPartNumber=DP83848C&fileType=pdf; PinCount: 48; PackageReference: PT0048A
Y4 = CMP-27762-004169-1: XTAL Oscillator 50MHz ±25ppm CMOS 3.3V 4-SMD 3.2mm x 2.5mm; Max Supply Voltage: 3.465V; Min Supply Voltage: 3.135V; Max Supply Current: 19mA; Load Capacitance: 15pF; Width: 0.098inch; Min Operating Temperature: -40°C; Number of Pins: 4; Frequency: 50MHz; Case/Package: SMD/SMT; REACH SVHC: No SVHC; Height: 0.047inch; Frequency Stability: 25ppm; Mount: Surface Mount; Package Quantity: 1000; Operating Supply Voltage: 3.3V; Max Operating Temperature: 85°C; Packaging: Tape and Reel; Length: 0.126inch; Series: ASE

## Sheet Memory+GPIO.SchDoc
size A4; SheetNumber: 6; SheetTotal: 6
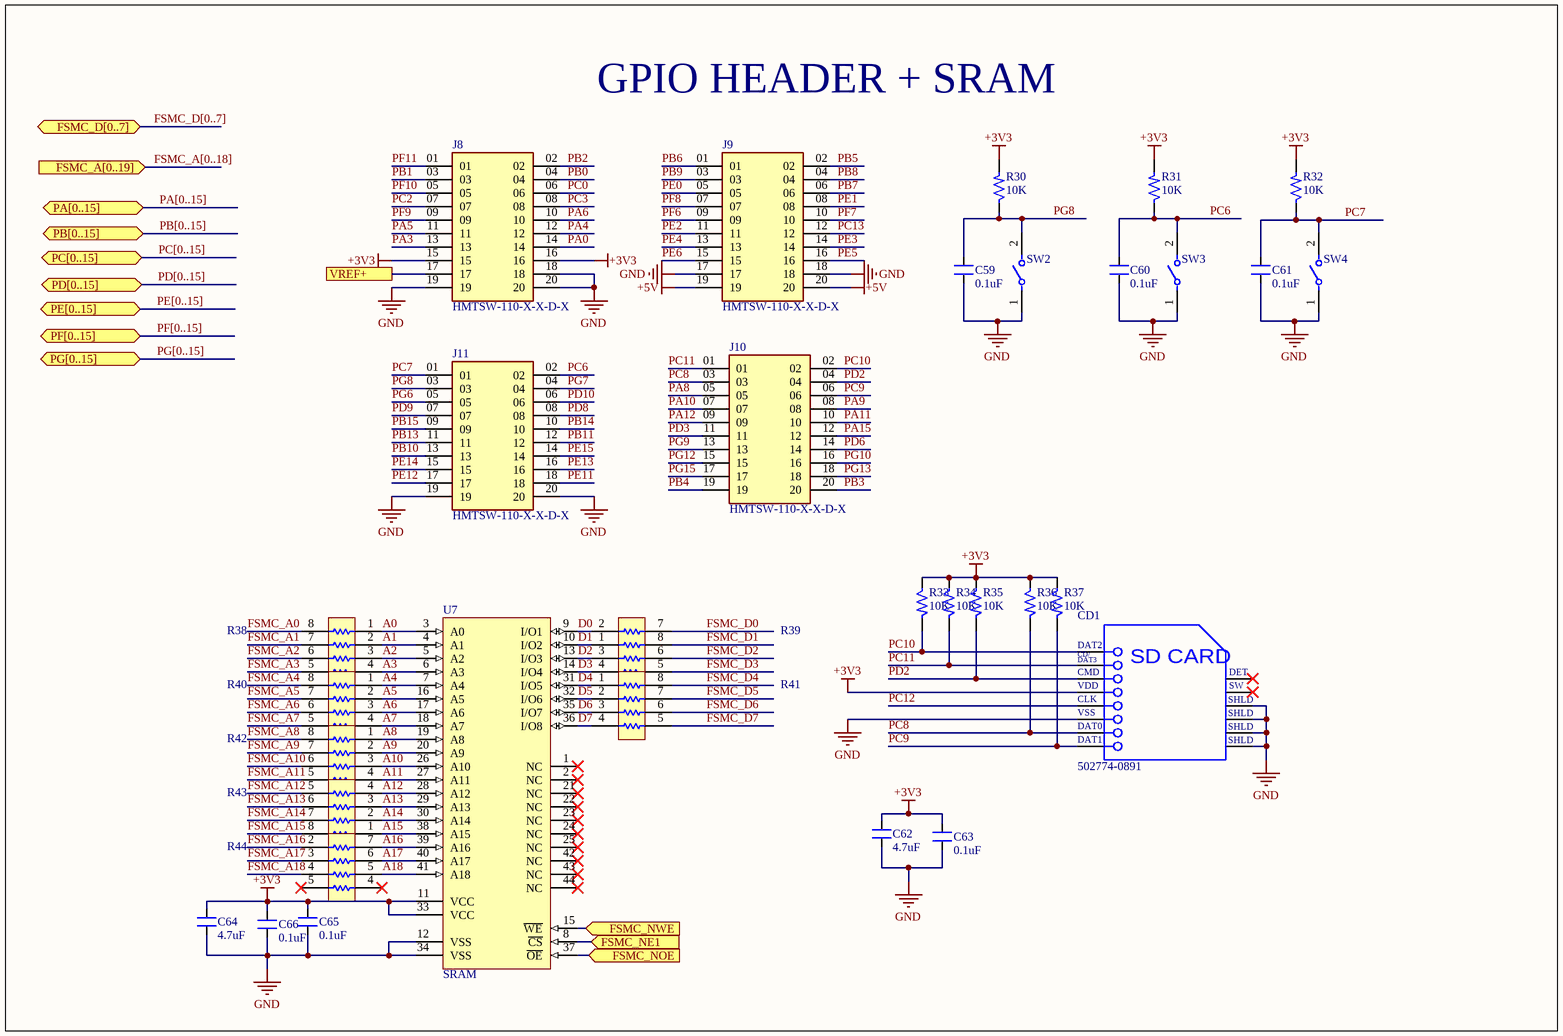
[diagram p5: Memory+GPIO.SchDoc]

### Parts
C59  0.1uF  [CAP_0805]
C60  0.1uF  [CAP_0805]
C61  0.1uF  [CAP_0805]
C62  4.7uF  [CAP_0805]
C63  0.1uF  [CAP_0805]
C64  4.7uF  [CAP_0805]
C65  0.1uF  [CAP_0805]
C66  0.1uF  [CAP_0805]
CD1  502774-0891  [MOLX-502774-0891_V]
J8  HMTSW-110-X-X-D-X  [SAMTEC_HMTSW-110-X-X-D-X]
J9  HMTSW-110-X-X-D-X  [SAMTEC_HMTSW-110-X-X-D-X]
J10  HMTSW-110-X-X-D-X  [SAMTEC_HMTSW-110-X-X-D-X]
J11  HMTSW-110-X-X-D-X  [SAMTEC_HMTSW-110-X-X-D-X]
R30  10K  [RES_0603]
R31  10K  [RES_0603]
R32  10K  [RES_0603]
R33  10K  [RES_0805]
R34  10K  [RES_0805]
R35  10K  [RES_0805]
R36  10K  [RES_0805]
R37  10K  [RES_0805]
R38  CAT16-103J4LF  [BOUR-CAT16-103J4LF_L]  (value not drawn)
R39  CAT16-103J4LF  [BOUR-CAT16-103J4LF_L]  (value not drawn)
R40  CAT16-103J4LF  [BOUR-CAT16-103J4LF_L]  (value not drawn)
R41  CAT16-103J4LF  [BOUR-CAT16-103J4LF_L]  (value not drawn)
R42  CAT16-103J4LF  [BOUR-CAT16-103J4LF_L]  (value not drawn)
R43  CAT16-103J4LF  [BOUR-CAT16-103J4LF_L]  (value not drawn)
R44  CAT16-103J4LF  [BOUR-CAT16-103J4LF_L]  (value not drawn)
SW2  147873-1  [FP-147873-1-MFG]  (value not drawn)
SW3  147873-1  [FP-147873-1-MFG]  (value not drawn)
SW4  147873-1  [FP-147873-1-MFG]  (value not drawn)
U7  SRAM  [CYP-TSOP-44_L]

### Ports
FSMC_A[0..19] (in, see MCU[3D]), FSMC_D[0..7] (bidir, see MCU[3D]), FSMC_NE1 (in, see MCU[2B]), FSMC_NOE (in, see MCU[2B]), FSMC_NWE (in, see MCU[2B]), PA[0..15] (bidir, see MCU[4D]), PB[0..15] (bidir, see MCU[4D]), PC[0..15] (bidir, see MCU[4D]), PD[0..15] (bidir, see MCU[4D]), PE[0..15] (bidir, see MCU[4D]), PF[0..15] (bidir, see MCU[4D]), PG[0..15] (bidir, see MCU[4D]), VREF+ (see MCU[3C])

### Nets
+3V3: C62.2 C63.2 C64.2 C65.2 C66.2 CD1.4(VDD) J8.15 J8.16 R30.2 R31.2 R32.2 R33.1 R34.1 R35.1 R36.1 R37.1 U7.11(VCC) U7.33(VCC)
+5V: J9.19 J9.20
GND: C59.1 C60.1 C61.1 C62.1 C63.1 C64.1 C65.1 C66.1 CD1.6(VSS) CD1.11(SHLD) CD1.12(SHLD) CD1.13(SHLD) CD1.14(SHLD) J8.18 J8.19 J8.20 J9.17 J9.18 J11.19 J11.20 SW2.1 SW3.1 SW4.1 U7.12(VSS) U7.34(VSS)
A0: R38.1 U7.3(A0)
A1: R38.2 U7.4(A1)
A2: R38.3 U7.5(A2)
A3: R38.4 U7.6(A3)
A4: R40.1 U7.7(A4)
A5: R40.2 U7.16(A5)
A6: R40.3 U7.17(A6)
A7: R40.4 U7.18(A7)
A8: R42.1 U7.19(A8)
A9: R42.2 U7.20(A9)
A10: R42.3 U7.26(A10)
A11: R42.4 U7.27(A11)
A12: R43.4 U7.28(A12)
A13: R43.3 U7.29(A13)
A14: R43.2 U7.30(A14)
A15: R43.1 U7.38(A15)
A16: R44.7 U7.39(A16)
A17: R44.6 U7.40(A17)
A18: R44.5 U7.41(A18)
D0: R39.2 U7.9(I/O1)
D1: R39.1 U7.10(I/O2)
D2: R39.3 U7.13(I/O3)
D3: R39.4 U7.14(I/O4)
D4: R41.1 U7.31(I/O5)
D5: R41.2 U7.32(I/O6)
D6: R41.3 U7.35(I/O7)
D7: R41.4 U7.36(I/O8)
FSMC_A0: R38.8
FSMC_A1: R38.7
FSMC_A2: R38.6
FSMC_A3: R38.5
FSMC_A4: R40.8
FSMC_A5: R40.7
FSMC_A6: R40.6
FSMC_A7: R40.5
FSMC_A8: R42.8
FSMC_A9: R42.7
FSMC_A10: R42.6
FSMC_A11: R42.5
FSMC_A12: R43.5
FSMC_A13: R43.6
FSMC_A14: R43.7
FSMC_A15: R43.8
FSMC_A16: R44.2
FSMC_A17: R44.3
FSMC_A18: R44.4
FSMC_D0: R39.7
FSMC_D1: R39.8
FSMC_D2: R39.6
FSMC_D3: R39.5
FSMC_D4: R41.8
FSMC_D5: R41.7
FSMC_D6: R41.6
FSMC_D7: R41.5
FSMC_NE1: U7.8(~{CS}) ; port FSMC_NE1
FSMC_NOE: U7.37(~{OE}) ; port FSMC_NOE
FSMC_NWE: U7.15(~{WE}) ; port FSMC_NWE
PA0: J8.14
PA3: J8.13
PA4: J8.12
PA5: J8.11
PA6: J8.10
PA8: J10.05
PA9: J10.08
PA10: J10.07
PA11: J10.10
PA12: J10.09
PA15: J10.12
PB0: J8.04
PB1: J8.03
PB2: J8.02
PB3: J10.20
PB4: J10.19
PB5: J9.02
PB6: J9.01
PB7: J9.06
PB8: J9.04
PB9: J9.03
PB10: J11.13
PB11: J11.12
PB13: J11.11
PB14: J11.10
PB15: J11.09
PC0: J8.06
PC2: J8.07
PC3: J8.08
PC6: C60.2 J11.02 R31.1 SW3.2
PC7: C61.2 J11.01 R32.1 SW4.2
PC8: CD1.7(DAT0) J10.03 R36.2
PC9: CD1.8(DAT1) J10.06 R37.2
PC10: CD1.1(DAT2) J10.02 R33.2
PC11: CD1.2(CD/DAT3) J10.01 R34.2
PC12: CD1.5(CLK)
PC13: J9.12
PD2: CD1.3(CMD) J10.04 R35.2
PD3: J10.11
PD6: J10.14
PD8: J11.08
PD9: J11.07
PD10: J11.06
PE0: J9.05
PE1: J9.08
PE2: J9.11
PE3: J9.14
PE4: J9.13
PE5: J9.16
PE6: J9.15
PE11: J11.18
PE12: J11.17
PE13: J11.16
PE14: J11.15
PE15: J11.14
PF6: J9.09
PF7: J9.10
PF8: J9.07
PF9: J8.09
PF10: J8.05
PF11: J8.01
PG6: J11.05
PG7: J11.04
PG8: C59.2 J11.03 R30.1 SW2.2
PG9: J10.13
PG10: J10.16
PG12: J10.15
PG13: J10.18
PG15: J10.17
VREF+: J8.17 ; port VREF+

Not connected (* = marked no-connect by the designer): CD1 9(DETECT)* 10(SWITCH)*; U7 1(NC)* 2(NC)* 21(NC)* 22(NC)* 23(NC)* 24(NC)* 25(NC)* 42(NC)* 43(NC)* 44(NC)*

### Buses and harness runs
bus FSMC_A[0..18] = port FSMC_A[0..19]
bus FSMC_D[0..7] = port FSMC_D[0..7]
bus PA[0..15] = port PA[0..15]
bus PB[0..15] = port PB[0..15]
bus PC[0..15] = port PC[0..15]
bus PD[0..15] = port PD[0..15]
bus PE[0..15] = port PE[0..15]
bus PF[0..15] = port PF[0..15]
bus PG[0..15] = port PG[0..15]

### Notes on the sheet
- GPIO HEADER + SRAM
- (in symbol CMP-2000-05248-1) CD/; DAT3; SD CARD; DET; SW

### Library data of the parts
C59-C61 C63 C65 C66 = CAP_0.1uF-50V-10%-0805: as C1 on sheet Power; Case/Package: 0805; Supplier-1: SIRICOM; Supplier Part Number-1: 0805B104K500CT
C62 C64 = CAP_4.7uF-50V-10%-0805: as C11 on sheet ST-link V2; Case/Package: 0805; Supplier-1: SIRICOM; Supplier Part Number-1: CL21A475KBQNNNE
CD1 = CMP-2000-05248-1: Micro SD Memory Card Connector, 0.5 A, 10 V (DC), -25 to 85 degC, 8-Pin SMT, RoHS, Tape and Reel; Manufacturer: Molex; 3D Model: 502774-0891.stp; Online Catalog: microSD™Series; Number of Positions: 10(8+2); Card Type: SecureDigital-microSD™; Insertion, Removal Method: PushIn,PushOut; Other Names: WM24066DKR; Connector Type: ConnectorandEjector; Features: Switch; Family: MemoryConnectors-PCCardSockets; Manufacturer URL: http://www.molex.com/; Mounting Type: SurfaceMount,RightAngle; Contact Finish Thickness: 20µin(0.51µm); Standard Package: 1; Series: 502774; Ejector Side: -; Datasheet Version: Rev. D, 04/2004; Category: Connectors,Interconnects; Contact Finish: Gold; Datasheet URL: https://datasheet.ciiva.com/1104/1499551-1104671.pdf; RoHS Information: 502774-0891CertofCompliance; Mounting Feature: Reverse-Bottom; Packaging: Digi-Reel; Height Above Board: 0.071"(1.80mm); Catalog Drawings: 502774-0891
J8-J11 = HMTSW-110-X-X-D-X: HEADER, 20 CONTACTS, 2 ROWS, THROUGH HOLE, 2.54 MM; Connector Systems:Board-to-Board; Pitch Spacing:2.54mm; No. of Rows:2Rows; No. of Contacts:20Contacts; Contact Termination Type:Through Hole; Product Range:HMTSW Series RoHS Compliant: Yes; MF: Samtec; MP: HMTSW11008LMD330; SnapEDA_Link: https://www.snapeda.com/parts/HMTSW11008LMD330/Samtec/view-part/?ref=snap; Package: None; Value: *; Check_prices: https://www.snapeda.com/parts/HMTSW11008LMD330/Samtec/view-part/?ref=eda
R30-R32 = RES_10K-0.1W-1%-0603: as R2 on sheet ST-link V2; Case/Package: 0603; Supplier-1: SIRICOM; Supplier Part Number-1: WR06X1002FTL
R33-R37 = RES_10K-0.125W-1%-0805: as R16 on sheet ETH; Case/Package: 0805; Supplier-1: SIRICOM; Supplier Part Number-1: WR08X1002FTL; Alternate Part Number-1: WR08X1002FTL
R38-R44 = CMP-2000-06067-1: CAT / CAY 16 Series - Chip Resistor Array, 10 KOhm, +/- 5%, 50 V, -55 to 125 degC, 8-Pin SMD, RoHS, Tape and Reel; Manufacturer: Bourns; Power Per Element: 62.5mW; Online Catalog: CAT16Series; Resistance (Ohms): 10k; Number of Resistors: 4; EDA / CAD Models: DownloadfromAcceleratedDesigns; Temperature Coefficient: ±200ppm/°C; Circuit Type: Isolated; Other Names: CAT16-103J4LFDKR; Package Reference: CAT16-103J4LF; Datasheet Version: 09/2014; Series: CAT16; Manufacturer URL: http://www.bourns.com/; Mounting Type: SurfaceMount; Datasheet URL: http://www.mouser.com/ds/2/54/ATCAY-777361.pdf; Category: Resistors; Height: 0.024"(0.60mm); Mounting Technology: SurfaceMount; Applications: -; Size / Dimension: 0.126"Lx0.061"W(3.20mmx1.55mm); Packaging: Digi-Reel®; Package / Case: 1206(3216Metric),Concave,LongSideTerminals; Supplier Device Package: 1206; RoHS Information: CAT16MaterialDeclaration; Number of Pins: 8; Family: ResistorNetworks,Arrays; Standard Package: 1; Package Description: 8-Pin Surface Mount Device, Body 3.2 x 1.55 mm, Pitch 0.8 mm; Operating Temperature: -55°C~125°C; Tolerance: ±5%
SW2-SW4 = CMP-03407-000005-1: as SW1 on sheet MCU; Throw Configuration: SPST-NO; Mouser Description: Switch Tactile OFF (ON) SPST Rectangular Button J-Bend 0.05A 24VDC 1.77N SMD T/R; Mount: Surface Mount; Height: 5.5mm; Category: Switch; RoHS: TRUE; Temperature Range High: +85°C; ComponentLink2Description: Datasheet; Temperature Range Low: -35°C; Device Class L1: Electromechanical; Device Class L2: Switches; Package: 0; Temperature: -35°C to +85°C; Device Class L3: Tactile Switches; Automotive: No; Manufacturer Part Number: 147873-1; ComponentLink2URL: https://www.te.com/commerce/DocumentDelivery/DDEController?Action=showdoc&DocId=Customer+Drawing%7F147873%7FK3%7Fpdf%7FEnglish%7FENG_CD_147873_K3.pdf%7F147873-1; Lead Free: Yes; Voltage Rating Dc: 24V; Octopart: https://octopart.com/147873-1-te+connectivity-40818451; Digikey Description: SWITCH TACTILE SPST-NO 0.05A 24V
U7 = CMP-2000-06133-1: 4-Mbit (256 K x 16) Static RAM, 3 to 3.6 V, -40 to 85 degC, 44-Pin TSOP, RoHS, Tray; Manufacturer: Cypress; Sync/Async: Asynchronous; Clock Freq: NotRequiredMHz; Access Time (Max): 10ns; Number of Words: 256Kword; Rad Hardened: No; Operating Supply Voltage (Max): 3.6V; Number of Ports: 1; Word Size: 16b; Architecture: NotRequired; Density: 4194304Bit; Address Bus: 18b; Operating Supply Voltage (Typ): 3.3V; Supply Current: 90mA; Operating Supply Voltage (Min): 3V; Manufacturer URL: http://www.cypress.com/; Datasheet URL: http://www.cypress.com/file/42801/download; Operating Temp Range: -40Cto85C; Datasheet Version: Rev. *N, 12/2014; Access Time: 10ns; Package Type: TSOP-II; Package Description: 44-Pin Thin Small Outline Package, Body 18.415 x 10.16 mm, Pitch 0.8 mm; Operating Temperature Classification: Industrial; Mounting: SurfaceMount; Pin Count: 44; Clock Freq (Max): NotRequiredMHz; Packaging: Tray; Package Reference: TSOP-44; Mounting Technology: SurfaceMount

## Nets that join several sheets
5V_USB: Power (D2.A), ST-link V2 (J3.A4_B9 J3.B4_A9)
+3V3: Power (6 pins), ST-link V2 (19 pins), MCU (30 pins), ETH (25 pins), Memory+GPIO (18 pins)
+5V: Power (5 pins), Memory+GPIO (J9.19 J9.20)
GND: Power (15 pins), ST-link V2 (32 pins), MCU (37 pins), ETH (20 pins), Memory+GPIO (25 pins)
ETH_CRS_DV: MCU (U5.43), ETH (R21.1 U6.40)
ETH_MDC: MCU (U5.27), ETH (U6.31)
ETH_MDIO: MCU (U5.36), ETH (U6.30)
ETH_RXD0: MCU (U5.44), ETH (U6.43)
ETH_RXD1: MCU (U5.45), ETH (U6.44)
ETH_TX_EN: MCU (U5.126), ETH (U6.2)
ETH_TXD0: MCU (U5.73), ETH (U6.4)
ETH_TXD1: MCU (U5.129), ETH (U6.3)
FSMC_A0: MCU (U5.10), Memory+GPIO (R38.8)
FSMC_A1: MCU (U5.11), Memory+GPIO (R38.7)
FSMC_A2: MCU (U5.12), Memory+GPIO (R38.6)
FSMC_A3: MCU (U5.13), Memory+GPIO (R38.5)
FSMC_A4: MCU (U5.14), Memory+GPIO (R40.8)
FSMC_A5: MCU (U5.15), Memory+GPIO (R40.7)
FSMC_A6: MCU (U5.50), Memory+GPIO (R40.6)
FSMC_A7: MCU (U5.53), Memory+GPIO (R40.5)
FSMC_A8: MCU (U5.54), Memory+GPIO (R42.8)
FSMC_A9: MCU (U5.55), Memory+GPIO (R42.7)
FSMC_A10: MCU (U5.56), Memory+GPIO (R42.6)
FSMC_A11: MCU (U5.57), Memory+GPIO (R42.5)
FSMC_A12: MCU (U5.87), Memory+GPIO (R43.5)
FSMC_A13: MCU (U5.88), Memory+GPIO (R43.6)
FSMC_A14: MCU (U5.89), Memory+GPIO (R43.7)
FSMC_A15: MCU (U5.90), Memory+GPIO (R43.8)
FSMC_A16: MCU (U5.80), Memory+GPIO (R44.2)
FSMC_A17: MCU (U5.81), Memory+GPIO (R44.3)
FSMC_A18: MCU (U5.82), Memory+GPIO (R44.4)
FSMC_D0: MCU (U5.85), Memory+GPIO (R39.7)
FSMC_D1: MCU (U5.86), Memory+GPIO (R39.8)
FSMC_D2: MCU (U5.114), Memory+GPIO (R39.6)
FSMC_D3: MCU (U5.115), Memory+GPIO (R39.5)
FSMC_D4: MCU (U5.58), Memory+GPIO (R41.8)
FSMC_D5: MCU (U5.59), Memory+GPIO (R41.7)
FSMC_D6: MCU (U5.60), Memory+GPIO (R41.6)
FSMC_D7: MCU (U5.63), Memory+GPIO (R41.5)
FSMC_NE1: MCU (U5.123), Memory+GPIO (U7.8)
FSMC_NOE: MCU (U5.118), Memory+GPIO (U7.37)
FSMC_NWE: MCU (U5.119), Memory+GPIO (U7.15)
JTCK_F407: ST-link V2 (R4.2 R12.2), MCU (U5.109)
JTMS_F407: ST-link V2 (R3.2 R10.2), MCU (U5.105)
OSC_IN: MCU (U5.35), ETH (U6.34 Y4.3)
PA0: MCU (U5.34), Memory+GPIO (J8.14)
PA3: MCU (U5.37), Memory+GPIO (J8.13)
PA4: MCU (U5.40), Memory+GPIO (J8.12)
PA5: MCU (U5.41), Memory+GPIO (J8.11)
PA6: MCU (U5.42), Memory+GPIO (J8.10)
PA8: MCU (U5.100), Memory+GPIO (J10.05)
PA9: ST-link V2 (J5.2 U4.7), MCU (U5.101), Memory+GPIO (J10.08)
PA10: ST-link V2 (J5.1 U4.6), MCU (U5.102), Memory+GPIO (J10.07)
PA11: MCU (U5.103), Memory+GPIO (J10.10)
PA12: MCU (U5.104), Memory+GPIO (J10.09)
PA15: MCU (U5.110), Memory+GPIO (J10.12)
PB0: MCU (U5.46), Memory+GPIO (J8.04)
PB1: MCU (U5.47), Memory+GPIO (J8.03)
PB2: MCU (U5.48), Memory+GPIO (J8.02)
PB3: MCU (U5.133), Memory+GPIO (J10.20)
PB4: MCU (U5.134), Memory+GPIO (J10.19)
PB5: MCU (U5.135), Memory+GPIO (J9.02)
PB6: MCU (U5.136), Memory+GPIO (J9.01)
PB7: MCU (U5.137), Memory+GPIO (J9.06)
PB8: MCU (U5.139), Memory+GPIO (J9.04)
PB9: MCU (U5.140), Memory+GPIO (J9.03)
PB10: MCU (U5.69), Memory+GPIO (J11.13)
PB11: MCU (U5.70), Memory+GPIO (J11.12)
PB13: MCU (U5.74), Memory+GPIO (J11.11)
PB14: MCU (U5.75), Memory+GPIO (J11.10)
PB15: MCU (U5.76), Memory+GPIO (J11.09)
PC0: MCU (U5.26), Memory+GPIO (J8.06)
PC2: MCU (U5.28), Memory+GPIO (J8.07)
PC3: MCU (U5.29), Memory+GPIO (J8.08)
PC6: MCU (U5.96), Memory+GPIO (C60.2 J11.02 R31.1 SW3.2)
PC7: MCU (U5.97), Memory+GPIO (C61.2 J11.01 R32.1 SW4.2)
PC8: MCU (U5.98), Memory+GPIO (CD1.7 J10.03 R36.2)
PC9: MCU (U5.99), Memory+GPIO (CD1.8 J10.06 R37.2)
PC10: MCU (U5.111), Memory+GPIO (CD1.1 J10.02 R33.2)
PC11: MCU (U5.112), Memory+GPIO (CD1.2 J10.01 R34.2)
PC12: MCU (U5.113), Memory+GPIO (CD1.5)
PC13: MCU (U5.7), Memory+GPIO (J9.12)
PD2: MCU (U5.116), Memory+GPIO (CD1.3 J10.04 R35.2)
PD3: MCU (U5.117), Memory+GPIO (J10.11)
PD6: MCU (U5.122), Memory+GPIO (J10.14)
PD8: MCU (U5.77), Memory+GPIO (J11.08)
PD9: MCU (U5.78), Memory+GPIO (J11.07)
PD10: MCU (U5.79), Memory+GPIO (J11.06)
PE0: MCU (U5.141), Memory+GPIO (J9.05)
PE1: MCU (U5.142), Memory+GPIO (J9.08)
PE2: MCU (U5.1), Memory+GPIO (J9.11)
PE3: MCU (U5.2), Memory+GPIO (J9.14)
PE4: MCU (U5.3), Memory+GPIO (J9.13)
PE5: MCU (U5.4), Memory+GPIO (J9.16)
PE6: MCU (U5.5), Memory+GPIO (J9.15)
PE11: MCU (U5.64), Memory+GPIO (J11.18)
PE12: MCU (U5.65), Memory+GPIO (J11.17)
PE13: MCU (U5.66), Memory+GPIO (J11.16)
PE14: MCU (U5.67), Memory+GPIO (J11.15)
PE15: MCU (U5.68), Memory+GPIO (J11.14)
PF6: MCU (U5.18), Memory+GPIO (J9.09)
PF7: MCU (U5.19), Memory+GPIO (J9.10)
PF8: MCU (U5.20), Memory+GPIO (J9.07)
PF9: MCU (U5.21), Memory+GPIO (J8.09)
PF10: MCU (U5.22), Memory+GPIO (J8.05)
PF11: MCU (U5.49), Memory+GPIO (J8.01)
PG6: MCU (U5.91), Memory+GPIO (J11.05)
PG7: MCU (U5.92), Memory+GPIO (J11.04)
PG8: MCU (U5.93), Memory+GPIO (C59.2 J11.03 R30.1 SW2.2)
PG9: MCU (U5.124), Memory+GPIO (J10.13)
PG10: MCU (U5.125), Memory+GPIO (J10.16)
PG12: MCU (U5.127), Memory+GPIO (J10.15)
PG13: MCU (U5.128), Memory+GPIO (J10.18)
PG15: MCU (U5.132), Memory+GPIO (J10.17)
VREF+: MCU (FB1.2), Memory+GPIO (J8.17)